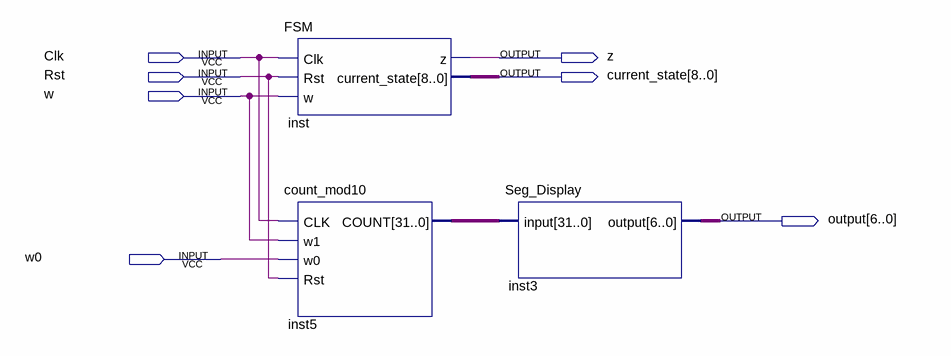
[diagram p0: schematic sheet]
// Quartus schematic Block1.bdf as structural Verilog: 3 symbols, 7 pins
module Block1 (
  input  Clk,
  input  Rst,
  input  w,
  input  w0,
  output z,
  output [8:0] current_state,
  output [6:0] \output 
);

  wire [31:0] inst5_count;

  FSM inst (.Clk(Clk), .Rst(Rst), .w(w), .z(z), .current_state(current_state));
  count_mod10 inst5 (.CLK(Clk), .w1(w), .w0(w0), .Rst(Rst), .COUNT(inst5_count));
  Seg_Display inst3 (.\input (inst5_count), .\output (\output ));
endmodule
